# Altium schematic sheet RcTransmitterMC.SchDoc
size 297 x 203 mm; SheetNumber: 2; SheetTotal: 3
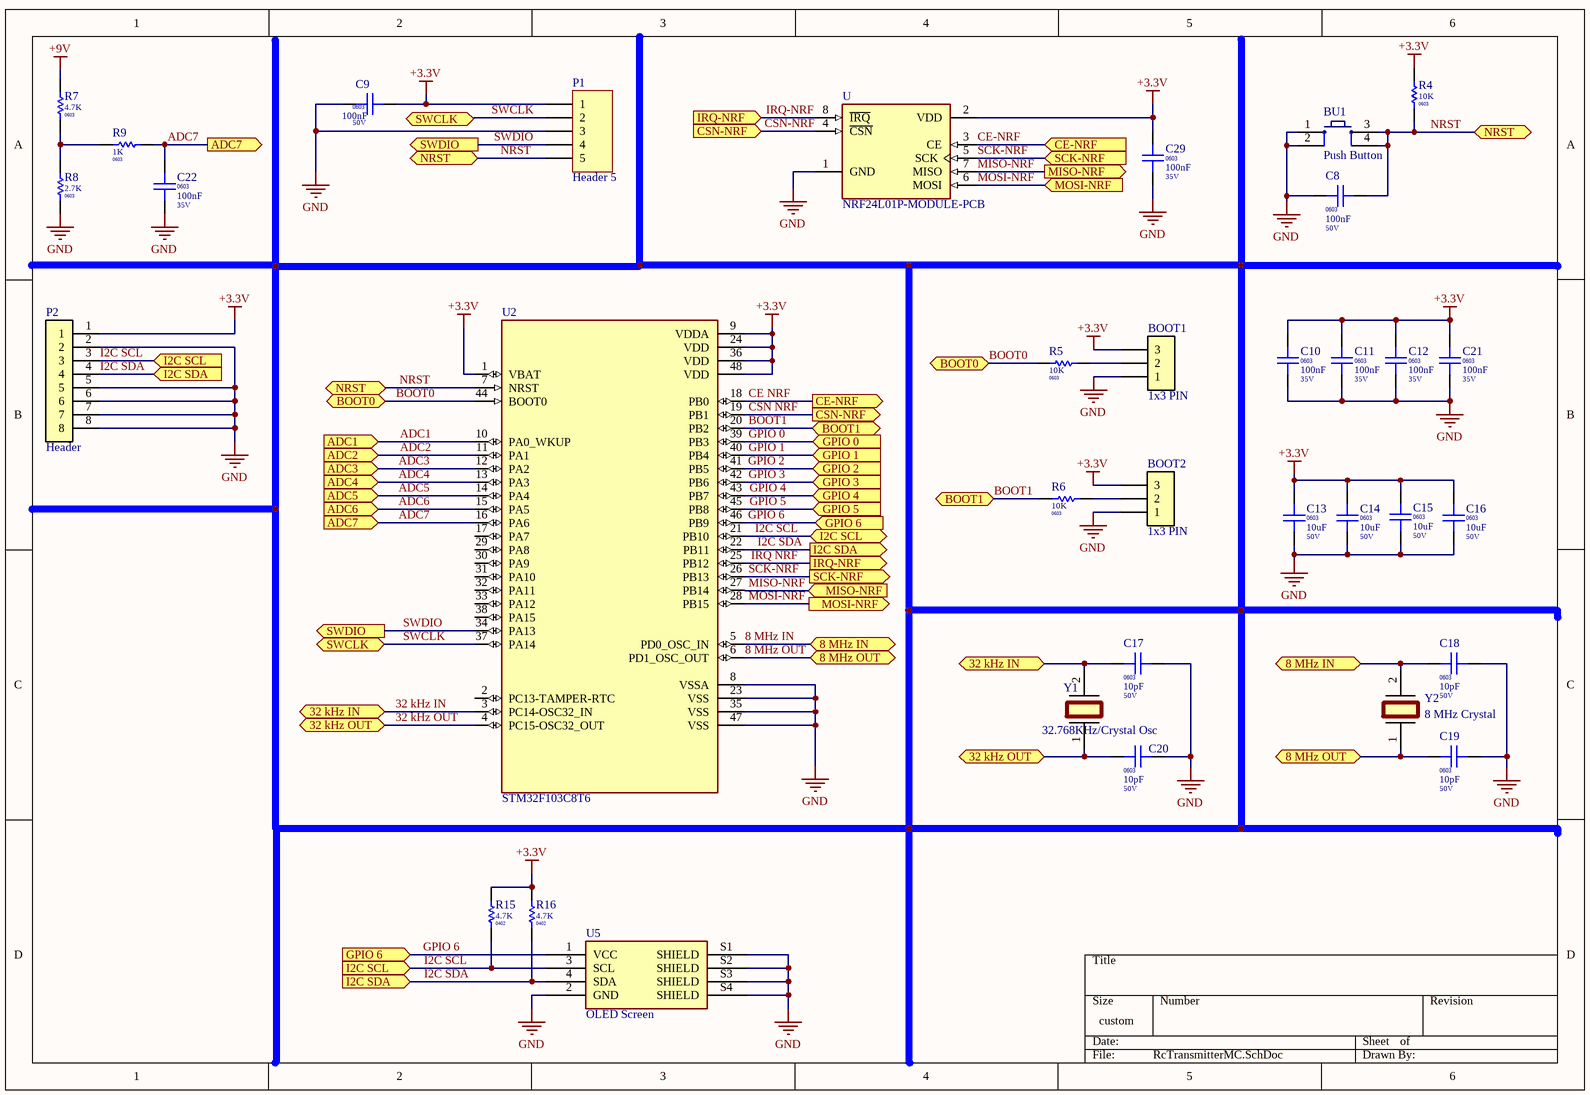
[diagram p0: RcTransmitterMC.SchDoc]

## Parts
BOOT1  1x3 PIN  [HDR_2.54_1X3]
BOOT2  1x3 PIN  [HDR_2.54_1X3]
BU1  Push Button  [button son]
C8  Package / Case: 0603  Voltage: 50V  [CAPC 0603]  (hidden comment: 100nF)
C9  Package / Case: 0603  Voltage: 50V  [CAPC 0603]  (hidden comment: 100nF)
C10  Package / Case: 0603  Voltage: 35V  [CAPC 0603]  (hidden comment: 100nF)
C11  Package / Case: 0603  Voltage: 35V  [CAPC 0603]  (hidden comment: 100nF)
C12  Package / Case: 0603  Voltage: 35V  [CAPC 0603]  (hidden comment: 100nF)
C13  Package / Case: 0603  Voltage: 50V  [CAPC 0603]  (hidden comment: 10uF)
C14  Package / Case: 0603  Voltage: 50V  [CAPC 0603]  (hidden comment: 10uF)
C15  Package / Case: 0603  Voltage: 50V  [CAPC 0603]  (hidden comment: 10uF)
C16  Package / Case: 0603  Voltage: 50V  [CAPC 0603]  (hidden comment: 10uF)
C17  Package / Case: 0603  Voltage: 50V  [CAPC 0603]  (hidden comment: 10pF)
C18  Package / Case: 0603  Voltage: 50V  [CAPC 0603]  (hidden comment: 10pF)
C19  Package / Case: 0603  Voltage: 50V  [CAPC 0603]  (hidden comment: 10pF)
C20  Package / Case: 0603  Voltage: 50V  [CAPC 0603]  (hidden comment: 10pF)
C21  Package / Case: 0603  Voltage: 35V  [CAPC 0603]  (hidden comment: 100nF)
C22  Package / Case: 0603  Voltage: 35V  [CAPC 0603]  (hidden comment: 100nF)
C29  Package / Case: 0603  Voltage: 35V  [CAPC 0603]  (hidden comment: 100nF)
P1  Header 5  [HDR1X5]
P2  Header  [IMU_HEADER]
R4  Package / Case: 0603  [RESC 0603]  (hidden comment: 10K)
R5  Package / Case: 0603  [RESC 0603]  (hidden comment: 10K)
R6  Package / Case: 0603  [RESC 0603]  (hidden comment: 10K)
R7  Package / Case: 0603  [RESC 0603]  (hidden comment: 4.7K)
R8  Package / Case: 0603  [RESC 0603]  (hidden comment: 2.7K)
R9  Package / Case: 0603  [RESC 0603]  (hidden comment: 1K)
R15  Package / Case: 0402  [RESC 0402]  (hidden comment: 4.7K)
R16  Package / Case: 0402  [RESC 0402]  (hidden comment: 4.7K)
U  NRF24L01P-MODULE-PCB  [nrf]
U2  STM32F103C8T6  [QFP50P900X900X160-48N]
U5  OLED Screen  [SSD1106 OLED]
Y1  32.768KHz/Crystal Osc  [32KhZ crystal oscillator]
Y2  8 MHz Crystal  [XTAL_HC49P488W43L1085T450H368]

## Ports
8 MHz IN (bidir), 8 MHz OUT (bidir), 32 kHz IN (bidir), 32 kHz OUT (bidir), ADC1 (in), ADC2 (in), ADC3 (in), ADC4 (in), ADC5 (in), ADC6 (in), ADC7 (in), ADC7 (out), BOOT0 (bidir), BOOT1 (bidir), CE-NRF (in), CE-NRF (out), CSN-NRF (in), CSN-NRF (out), GPIO 0 (in), GPIO 1 (in), GPIO 2 (in), GPIO 3 (in), GPIO 4 (in), GPIO 5 (in), GPIO 6 (in), I2C SCL (bidir), I2C SCL (in), I2C SDA (in), I2C SDA (out), IRQ-NRF (in), IRQ-NRF (out), MISO-NRF (in), MISO-NRF (out), MOSI-NRF (in), MOSI-NRF (out), NRST (bidir), SCK-NRF (in), SCK-NRF (out), SWCLK (bidir), SWDIO (out)

## Nets
+3.3V: BOOT1.3 BOOT2.3 C9.2 C10.2 C11.2 C12.2 C13.2 C14.2 C15.2 C16.2 C21.2 C29.2 P1.1 P2.1 R4.2 R15.2 R16.2 U.2(VDD) U2.1(VBAT) U2.9(VDDA) U2.24(VDD) U2.36(VDD) U2.48(VDD)
+9V: R7.2
GND: BOOT1.1 BOOT2.1 BU1.1 BU1.2 C8.1 C9.1 C10.1 C11.1 C12.1 C13.1 C14.1 C15.1 C16.1 C17.2 C18.2 C19.2 C20.2 C21.1 C22.1 C29.1 P1.3 P2.2 P2.5 P2.6 P2.7 P2.8 R8.1 U.1(GND) U2.8(VSSA) U2.23(VSS) U2.35(VSS) U2.47(VSS) U5.2(GND) U5.S1(SHIELD) U5.S2(SHIELD) U5.S3(SHIELD) U5.S4(SHIELD)
8 MHz IN: C18.1 U2.5(PD0_OSC_IN) Y2.2 ; port 8 MHz IN
8 MHz OUT: C19.1 U2.6(PD1_OSC_OUT) Y2.1 ; port 8 MHz OUT
32 kHz IN: C17.1 U2.3(PC14-OSC32_IN) Y1.2 ; port 32 kHz IN
32 kHz OUT: C20.1 U2.4(PC15-OSC32_OUT) Y1.1 ; port 32 kHz OUT
ADC1: U2.10(PA0_WKUP) ; port ADC1
ADC2: U2.11(PA1) ; port ADC2
ADC3: U2.12(PA2) ; port ADC3
ADC4: U2.13(PA3) ; port ADC4
ADC5: U2.14(PA4) ; port ADC5
ADC6: U2.15(PA5) ; port ADC6
ADC7: C22.2 R9.2 U2.16(PA6) ; port ADC7
BOOT0: R5.1 U2.44(BOOT0) ; port BOOT0
BOOT1: R6.1 U2.20(PB2) ; port BOOT1
CE NRF: U.3(CE) U2.18(PB0) ; port CE-NRF  [also labelled CE-NRF]
CSN NRF: U.4(~{CSN}) U2.19(PB1) ; port CSN-NRF  [also labelled CSN-NRF]
GPIO 0: U2.39(PB3) ; port GPIO 0
GPIO 1: U2.40(PB4) ; port GPIO 1
GPIO 2: U2.41(PB5) ; port GPIO 2
GPIO 3: U2.42(PB6) ; port GPIO 3
GPIO 4: U2.43(PB7) ; port GPIO 4
GPIO 5: U2.45(PB8) ; port GPIO 5
GPIO 6: U2.46(PB9) U5.1(VCC) ; port GPIO 6
I2C SCL: P2.3 R15.1 U2.21(PB10) U5.3(SCL) ; port I2C SCL
I2C SDA: P2.4 R16.1 U2.22(PB11) U5.4(SDA) ; port I2C SDA
IRQ NRF: U.8(~{IRQ}) U2.25(PB12) ; port IRQ-NRF  [also labelled IRQ-NRF]
MISO-NRF: U.7(MISO) U2.27(PB14) ; port MISO-NRF
MOSI-NRF: U.6(MOSI) U2.28(PB15) ; port MOSI-NRF
NRST: BU1.3 BU1.4 C8.2 P1.5 R4.1 U2.7(NRST) ; port NRST
SCK-NRF: U.5(SCK) U2.26(PB13) ; port SCK-NRF
SWCLK: P1.2 U2.37(PA14) ; port SWCLK
SWDIO: P1.4 U2.34(PA13) ; port SWDIO
NetBOOT1_2: BOOT1.2 R5.2
NetBOOT2_2: BOOT2.2 R6.2
NetR7_1: R7.1 R8.2 R9.1

Not connected (* = marked no-connect by the designer): U2 2(PC13-TAMPER-RTC) 17(PA7) 29(PA8) 30(PA9) 31(PA10) 32(PA11) 33(PA12) 38(PA15)

## Library data of the parts
BOOT1 BOOT2 = Connector0009: Header 2.54 1x3; Part Number: Connector0009; Category: Connectors; Package / Case: HDR_2.54_1X3; Values: Header 2.54 1x3
BU1 = Push Button: Smd Push Button; Satın Alma Linki: https://urun.n11.com/diger/mini-pushbutton-switch-smd-P227461537?gclid=Cj0KCQjwkoDmBRCcARIsAG3xzl8Y_-jeD7HocNM6lvuZ_rVp83568XPGtNzlPwXWLph8oCRqo0yh87UaApZYEALw_wcB&gclsrc=aw.ds
C8 C9 = CAPC0285: Capacitor Ceramic 100nF 50V 0603; Tolerance: %10; Value Rating: nF; Favorites: Favorite; Value: 100nF; Part Number: CAPC0285; Category: Capacitor Ceramic; Values: 100nF 50V
C10-C12 C21 C22 C29 = CAPC0328: Capacitor Ceramic 100nF 35V 0603; Tolerance: %10; Value Rating: nF; Value: 100nF; Part Number: CAPC0328; Category: Capacitor Ceramic; Values: 100nF 35V
C13-C16 = CAPC0301: Capacitor Ceramic 10uF 50V 0603; Tolerance: %10; Value Rating: uF; Value: 10uF; Part Number: CAPC0301; Category: Capacitor Ceramic; Values: 10uF 50V
C17-C20 = CAPC0242: Capacitor Ceramic 10pF 50V 0603; Tolerance: %10; Value Rating: pF; Value: 10pF; Part Number: CAPC0242; Category: Capacitor Ceramic; Values: 10pF 50V
P1 = Header 5: Header, 5-Pin; LatestRevisionDate: 17-Jul-2002; LatestRevisionNote: Re-released for DXP Platform.; Publisher: Altium Limited
P2 = IMU_HEADER: 1x8
R4-R6 = R0220: 10K 0603; Part Number: R0220; Tolerance: %5; Power: 1/10W; Value: 10K; Category: Resistor; Values: 10K
R7 = R0212: 4.7K 0603; Part Number: R0212; Tolerance: %5; Power: 1/10W; Value: 4.7K; Category: Resistor; Values: 4.7K
R8 = R0206: 2.7K 0603; Part Number: R0206; Tolerance: %5; Power: 1/10W; Value: 2.7K; Category: Resistor; Values: 2.7K
R9 = R0196: 1K 0603; Part Number: R0196; Tolerance: %5; Power: 1/10W; Value: 1K; Category: Resistor; Values: 1K
R15 R16 = R0066: 4.7K 0402; Part Number: R0066; Tolerance: %5; Power: 1/10W; Value: 4.7K; Category: Resistor; Values: 4.7K
U = NRF24L01P-MODULE-PCB: - Transceiver For Use With nRF24L01+; MF: Nordic Semiconductor; Package: None; MP: NRF24L01P-MODULE-PCB; Value: *; Availability: Bad; Price: None; SnapEDA_Link: https://www.snapeda.com/parts/NRF24L01P-MODULE-PCB/Nordic%20Semiconductor%20ASA/view-part/230534/?ref=snap; Mouser-Purchase-URL: https://snapeda.com/shop?store=Mouser&id=230534
U2 = STM32F103C8T6: ARMÂ® CortexÂ®-M3 STM32F1 Microcontroller IC 32-Bit 72MHz 64KB _64K x 8_ FLASH; MF: STMicroelectronics; Price: None; Package: LQFP-48 STMicroelectronics; Value: *; MP: STM32F103C8T6; Availability: Unavailable; SnapEDA_Link: https://www.snapeda.com/parts/STM32F103C8T6/STMicroelectronics/view-part/52195/?ref=snap
U5 = SSD1106 OLED
Y1 = NX3215SA-32.768KHZ-EXS00A-MU00525: Crystal or Oscillator; ComponentLink1Description: New link; ComponentLink1URL: *
Y2 = XTAL_HC49P488W43L1085T450H368